# Altium project Hyperloop_BTCU.PrjPcb
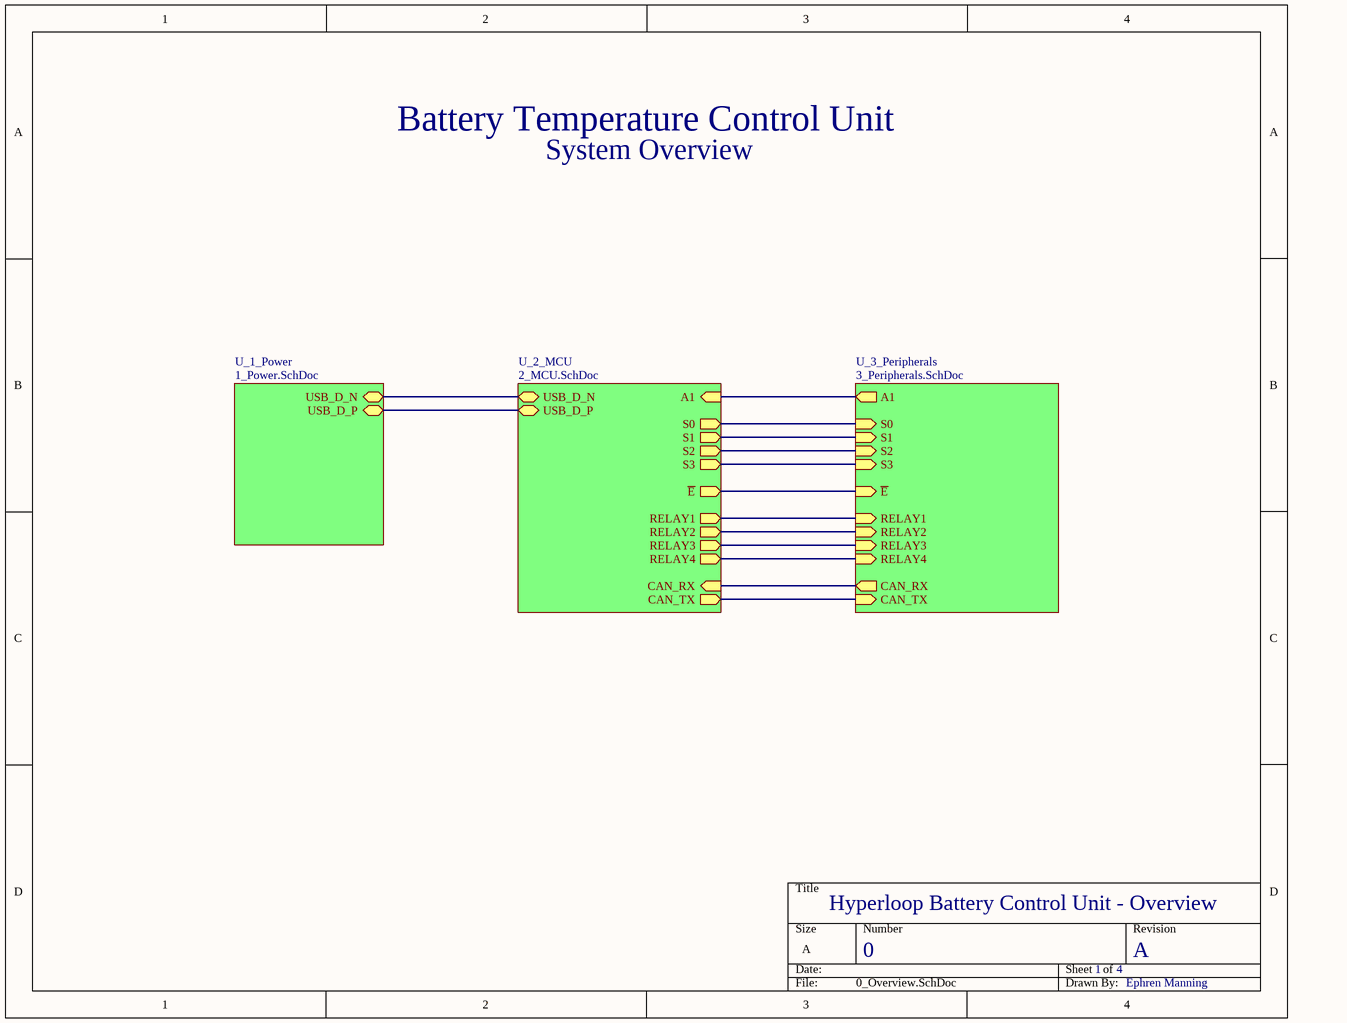
[diagram p0: 0_Overview.SchDoc]
4 sheets, 103 parts. Net scope: hierarchical (ports join the sheet entries above them; power ports are global).
Board file: Hyperloop_BTCU-PCB.PcbDoc
Sheets:
  0_Overview.SchDoc
    U_1_Power = 1_Power.SchDoc
    U_2_MCU = 2_MCU.SchDoc
    U_3_Peripherals = 3_Peripherals.SchDoc

## Sheet 0_Overview.SchDoc
size A; SheetNumber: 1; SheetTotal: 4

### Sub-sheets
U_1_Power = 1_Power.SchDoc: USB_D_N (bidir), USB_D_P (bidir)
U_2_MCU = 2_MCU.SchDoc: USB_D_P (bidir), USB_D_N (bidir), A1 (in), S0 (out), S1 (out), S2 (out), S3 (out), RELAY1 (out), RELAY2 (out), RELAY3 (out), RELAY4 (out), ~{E} (out), CAN_RX (in), CAN_TX (out)
U_3_Peripherals = 3_Peripherals.SchDoc: CAN_TX (in), CAN_RX (out), S0 (in), S1 (in), S2 (in), S3 (in), ~{E} (in), A1 (out), RELAY1 (in), RELAY2 (in), RELAY3 (in), RELAY4 (in)

### Nets
USB_D_N: sheet U_1_Power/USB_D_N, sheet U_2_MCU/USB_D_N
USB_D_P: sheet U_1_Power/USB_D_P, sheet U_2_MCU/USB_D_P
NetC6_2: sheet U_2_MCU/A1, sheet U_3_Peripherals/A1
NetR16_1: sheet U_2_MCU/RELAY1, sheet U_3_Peripherals/RELAY1
NetR18_1: sheet U_2_MCU/RELAY2, sheet U_3_Peripherals/RELAY2
NetR20_1: sheet U_2_MCU/RELAY3, sheet U_3_Peripherals/RELAY3
NetR22_1: sheet U_2_MCU/RELAY4, sheet U_3_Peripherals/RELAY4
NetR25_2: sheet U_2_MCU/~{E}, sheet U_3_Peripherals/~{E}
NetU4_28: sheet U_2_MCU/S3, sheet U_3_Peripherals/S3
NetU4_29: sheet U_2_MCU/S2, sheet U_3_Peripherals/S2
NetU4_30: sheet U_2_MCU/S1, sheet U_3_Peripherals/S1
NetU4_31: sheet U_2_MCU/S0, sheet U_3_Peripherals/S0
NetU4_45: sheet U_2_MCU/CAN_TX, sheet U_3_Peripherals/CAN_TX
NetU4_46: sheet U_2_MCU/CAN_RX, sheet U_3_Peripherals/CAN_RX

### Notes on the sheet
- Battery Temperature Control Unit
- System Overview
- Hyperloop Battery Control Unit - Overview
- 0
- 1
- 4
- A
- Ephren Manning

## Sheet 1_Power.SchDoc
size A; SheetNumber: 2; SheetTotal: 4
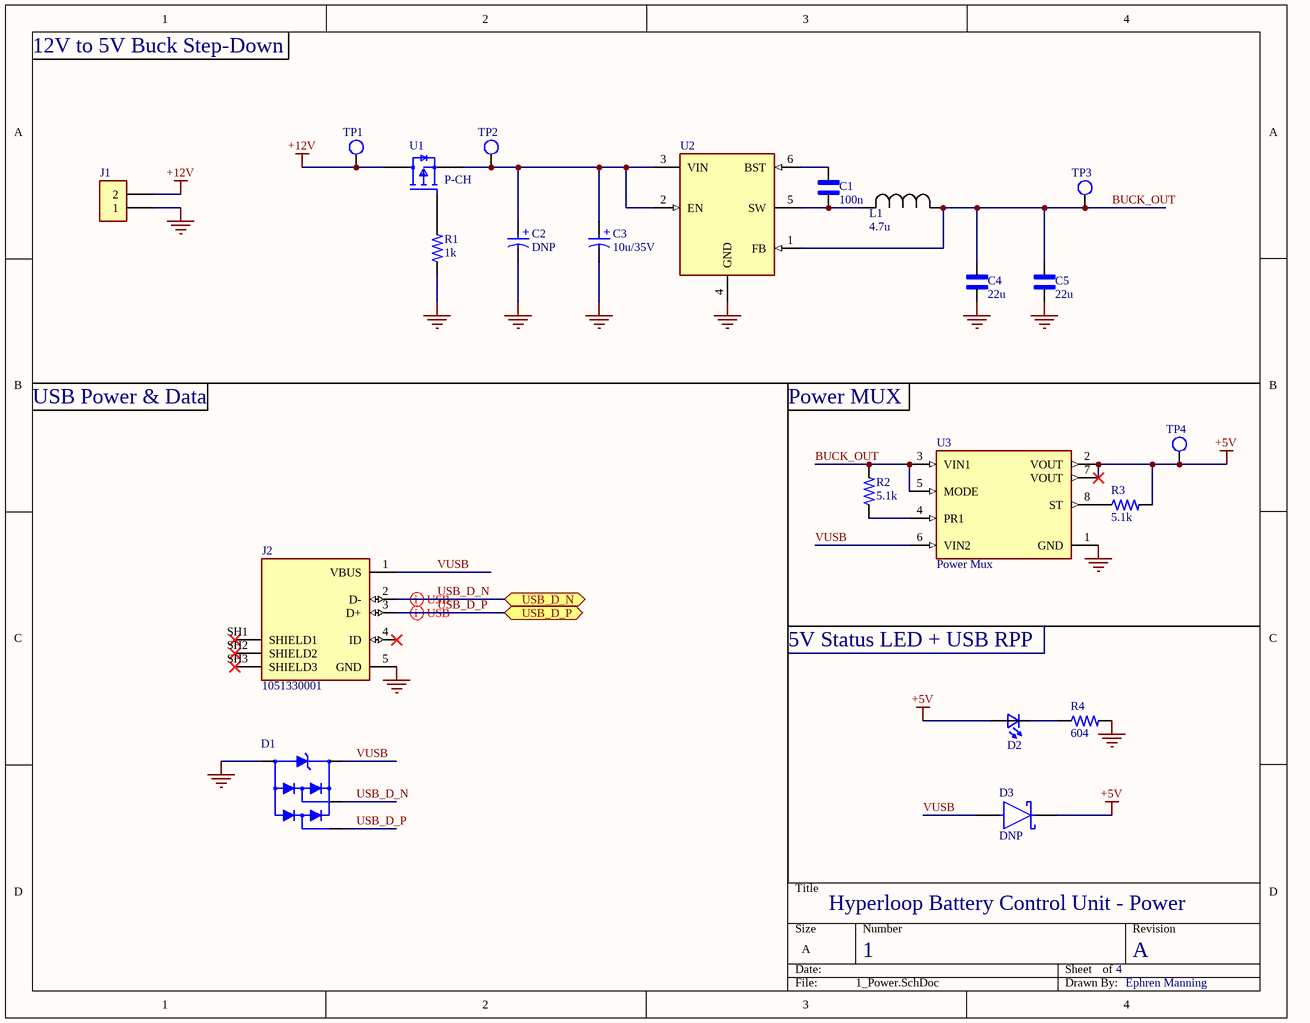
[diagram p1: 1_Power.SchDoc]

### Parts
C1  100n  [CAP_0603-Footprint]
C2  DNP  [WCAP-AS5H_D5H5.5]
C3  10u/35V  [WCAP-AS5H_D5H5.5]
C4  22u  [CAP_0603-Footprint]
C5  22u  [CAP_0603-Footprint]
D1  PRTR5V0U2X,215  [SOT143B]  (value not drawn)
D2  LTST-C191KGKT  [LED_0603-Footprint-1]  (value not drawn)
D3  DNP  [FP-SOD123W-MFG]
J1  282837-2  [TE_282837-2]  (value not drawn)
J2  1051330001  [MOLEX_1051330001]
L1  4.7u  [IND_SRP0412-1R0K_BRN]
R1  1k  [RES_0603-Footprint-1]
R2  5.1k  [RES_0603-Footprint-1]
R3  5.1k  [RES_0603-Footprint-1]
R4  604  [RES_0603-Footprint-1]
TP1  PTH Test Point  [PTH Test Point-Footprint-1]  (value not drawn)
TP2  PTH Test Point  [PTH Test Point-Footprint-1]  (value not drawn)
TP3  PTH Test Point  [PTH Test Point-Footprint-1]  (value not drawn)
TP4  PTH Test Point  [PTH Test Point-Footprint-1]  (value not drawn)
U1  P-CH  [SOT95P242X110-3N]
U2  AP63205WU-7  [FP-TSOT26-MFG]  (value not drawn)
U3  Power Mux  [SOTFL50P160X60-8N]

### Ports
USB_D_N (bidir, see 0_Overview[2B], 2_MCU[1A]), USB_D_P (bidir, see 0_Overview[2B], 2_MCU[1A])

### Nets
+5V: D2.2(A2) D3.1 R3.2 TP4.1 U3.2(VOUT) U3.7(VOUT)
+12V: J1.2 TP1.1 U1.3(Drain)
GND: C2.2(N) C3.2(N) C4.1 C5.1 D1.1(P$1) J1.1 J2.5(GND) R1.1 R4.2 U2.4(GND) U3.1(GND)
BUCK_OUT: C4.2 C5.2 L1.1 R2.2 TP3.1 U2.1(FB) U3.3(VIN1) U3.5(MODE)
USB_D_N: D1.2(P$2) J2.2(D-) ; port USB_D_N
USB_D_P: D1.3(P$3) J2.3(D+) ; port USB_D_P
VUSB: D1.4(P$4) D3.2 J2.1(VBUS) U3.6(VIN2)
NetC1_1: C1.1 L1.2 U2.5(SW)
NetC1_2: C1.2 U2.6(BST)
NetC2_1: C2.1(P) C3.1(P) TP2.1 U1.2(Source) U2.2(EN) U2.3(VIN)
NetD2_1: D2.1(K2) R4.1
NetR1_2: R1.2 U1.1(Gate)
NetR2_1: R2.1 U3.4(PR1)
NetR3_1: R3.1 U3.8(ST)

Not connected (* = marked no-connect by the designer): J2 4(ID)* SH1(SHIELD1)* SH2(SHIELD2)* SH3(SHIELD3)*

### Layout directives
differential pair: USB_D_N, USB_D_P

### Notes on the sheet
- 12V to 5V Buck Step-Down
- USB Power & Data
- Power MUX
- 5V Status LED + USB RPP
- Hyperloop Battery Control Unit - Power
- 1
- 4
- A
- Ephren Manning
- (in symbol CMP-00028-2) +

### Library data of the parts
C1 = CMP-00029-2: 100nF/16V ±10% Ceramic 0603; Manufacturer Part Number 1: CL10B104KO8NNNC; Manufacturer 1: Samsung Electro-Mechanics
C2 C3 = CMP-00028-2: ALUM 10uF 20% 35V SMD; Manufacturer 1: Würth Elektronik; Manufacturer Part Number 1: 865230542002
C4 C5 = CMP-00030-1: 22uF/10V CER 0603; Manufacturer Part Number 1: CL10A226MP8NUNE; Manufacturer 1: Samsung Electro-Mechanics
D1 = CMP-018-000000-4: Diode Array, ESD; Manufacturer 1: Nexperia USA Inc.; Manufacturer Part Number 1: PRTR5V0U2X,215
D2 = CMP-038-000000-5: Green 571nm LED Indication - Discrete 2V 0603 (1608 Metric); Manufacturer 1: Lite-On Inc.; Manufacturer Part Number 1: LTST-C191KGKT
D3 = CMP-00005-2: DIODE SCHOTTKY 60V 2A SOD123; RoHS Compliant: Yes
J1 = CMP-079-000000-3: 2x Screw Terminal; Manufacturer 1: TE Connectivity; Manufacturer Part Number 1: 282837-2
J2 = CMP-016-000000-5: Micro USB Type B 90 Degree Conn; Manufacturer 1: Molex; Manufacturer Part Number 1: 1051330001
L1 = CMP-007-000000-4: 4.7 uH 2.8A Inductor; Manufacturer 1: Bourns Electronics; Manufacturer Part Number 1: SRP0415-4R7K
R1 = CMP-00039-1: 1k 1% 0.1W 0603; Manufacturer 1: YAGEO; Manufacturer Part Number 1: RC0603FR-071KL
R2 R3 = CMP-028-000000-5: 5.1k Ohms ±1% 0.1W 0603; Manufacturer Part Number 1: RC0603FR-075K1L; Manufacturer 1: Yageo
R4 = CMP-00040-1: 604 Ohm 1% 1/10 W 0603; Manufacturer Part Number 1: RC0603FR-07604RL; Manufacturer 1: YAGEO
TP1-TP4 = CMP-00011-2: Plated through-hole test point to allow soldering in pin headers.
U1 = CMP-00025-1: Mosfet P-CH 30V 3.8A Vgs(ON) = -10V SOT23; Manufacturer 1: Diodes Incorporated; Manufacturer Part Number 1: DMP3099L-7
U2 = CMP-00003-3: AP63205 Series 32 V 2 A 1.1 MHz Synchronous Buck Converter -TSOT-26
U3 = CMP-064-000000-3: TPS2116, Power Mux, 1.6V to 5.5V, 2.5A, SOT-583; Manufacturer 1: Texas Instruments; Manufacturer Part Number 1: TPS2116DRLR; Package: SOT-583

## Sheet 2_MCU.SchDoc
size A; SheetNumber: 3; SheetTotal: 4
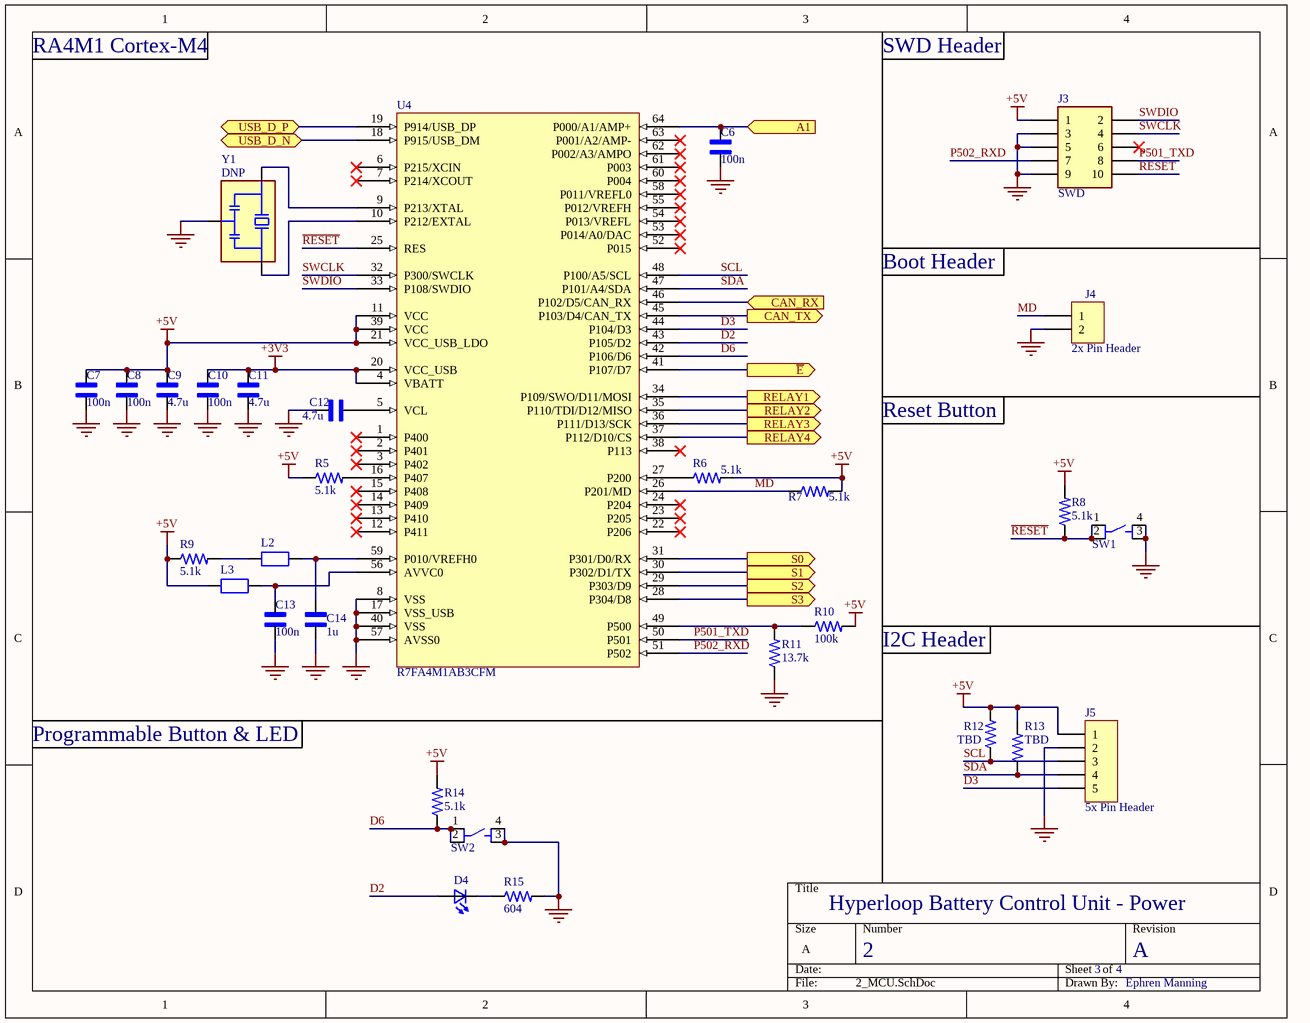
[diagram p2: 2_MCU.SchDoc]

### Parts
C6  100n  [CAP_0603-Footprint]
C7  100n  [CAP_0603-Footprint]
C8  100n  [CAP_0603-Footprint]
C9  4.7u  [CAP_0603-Footprint]
C10  100n  [CAP_0603-Footprint]
C11  4.7u  [CAP_0603-Footprint]
C12  4.7u  [CAP_0603-Footprint]
C13  100n  [CAP_0603-Footprint]
C14  1u  [CAP_0603-Footprint]
D4  LTST-C191KGKT  [LED_0603-Footprint-1]  (value not drawn)
J3  SWD  [CNC_3221-10-0100-00]
J4  2x Pin Header  [2x Pin Header-Footprint-1]
J5  5x Pin Header  [5x Pin Header-Footprint-1]
L2  BLM18PG471SN1D  [BEADC1608X95N]  (value not drawn)
L3  BLM18PG471SN1D  [BEADC1608X95N]  (value not drawn)
R5  5.1k  [RES_0603-Footprint-1]
R6  5.1k  [RES_0603-Footprint-1]
R7  5.1k  [RES_0603-Footprint-1]
R8  5.1k  [RES_0603-Footprint-1]
R9  5.1k  [RES_0603-Footprint-1]
R10  100k  [RES_0603-Footprint-1]
R11  13.7k  [RES_0603-Footprint-1]
R12  TBD  [RES_0603-Footprint-1]
R13  TBD  [RES_0603-Footprint-1]
R14  5.1k  [RES_0603-Footprint-1]
R15  604  [RES_0603-Footprint-1]
SW1  PTS810_SJM_250_SMTR_LFS  [SW_PTS810_SJM_250_SMTR_LFS]  (value not drawn)
SW2  PTS810_SJM_250_SMTR_LFS  [SW_PTS810_SJM_250_SMTR_LFS]  (value not drawn)
U4  R7FA4M1AB3CFM  [R7FA4M1AB3CFM-Footprint-1]
Y1  DNP  [OSC_CSTNE12M0G55Z000R0]

### Ports
A1 (in, see 0_Overview[3B], 3_Peripherals[2C]), CAN_RX (in, see 0_Overview[3C], 3_Peripherals[2A]), CAN_TX (out, see 0_Overview[3C], 3_Peripherals[2A]), RELAY1 (out, see 0_Overview[3C], 3_Peripherals[1A]), RELAY2 (out, see 0_Overview[3C], 3_Peripherals[1B]), RELAY3 (out, see 0_Overview[3C], 3_Peripherals[1C]), RELAY4 (out, see 0_Overview[3C], 3_Peripherals[1D]), S0 (out, see 0_Overview[3B], 3_Peripherals[2C]), S1 (out, see 0_Overview[3B], 3_Peripherals[2C]), S2 (out, see 0_Overview[3B], 3_Peripherals[2C]), S3 (out, see 0_Overview[3B], 3_Peripherals[2C]), USB_D_N (bidir, see 0_Overview[2B], 1_Power[2C]), USB_D_P (bidir, see 0_Overview[2B], 1_Power[2C]), ~{E} (out, see 0_Overview[3B], 3_Peripherals[2C])

### Nets
+3V3: C10.2 C11.2 U4.4(VBATT) U4.20(VCC_USB)
+5V: C7.2 C8.2 C9.2 J3.1 J5.1 L3.1 R5.1 R6.2 R7.2 R8.2 R9.1 R10.2 R12.2 R13.2 R14.2 U4.11(VCC) U4.21(VCC_USB_LDO) U4.39(VCC)
GND: C6.1 C7.1 C8.1 C9.1 C10.1 C11.1 C12.1 C13.1 C14.1 J3.3 J3.5 J3.9 J4.2 J5.2 R11.1 R15.2 SW1.3 SW1.4 SW2.3 SW2.4 U4.8(VSS) U4.17(VSS_USB) U4.40(VSS) U4.57(AVSS0) Y1.2(GND)
D2: D4.2(A2) U4.43(P105/D2)
D3: J5.5 U4.44(P104/D3)
D6: R14.1 SW2.1 SW2.2 U4.42(P106/D6)
MD: J4.1 R7.1 U4.26(P201/MD)
P501_TXD: J3.8 U4.50(P501)
P502_RXD: J3.7 U4.51(P502)
~{RESET}: J3.10 R8.1 SW1.1 SW1.2 U4.25(RES)
SCL: J5.3 R12.1 U4.48(P100/A5/SCL)
SDA: J5.4 R13.1 U4.47(P101/A4/SDA)
SWCLK: J3.4 U4.32(P300/SWCLK)
SWDIO: J3.2 U4.33(P108/SWDIO)
USB_D_N: U4.18(P915/USB_DM) ; port USB_D_N
USB_D_P: U4.19(P914/USB_DP) ; port USB_D_P
NetC6_2: C6.2 U4.64(P000/A1/AMP+) ; port A1
NetC12_2: C12.2 U4.5(VCL)
NetC13_2: C13.2 L3.2 U4.56(AVVC0)
NetC14_2: C14.2 L2.2 U4.59(P010/VREFH0)
NetD4_1: D4.1(K2) R15.1
NetL2_1: L2.1 R9.2
NetR5_2: R5.2 U4.16(P407)
NetR6_1: R6.1 U4.27(P200)
NetR10_1: R10.1 R11.2 U4.49(P500)
NetR16_1: U4.34(P109/SWO/D11/MOSI) ; port RELAY1
NetR18_1: U4.35(P110/TDI/D12/MISO) ; port RELAY2
NetR20_1: U4.36(P111/D13/SCK) ; port RELAY3
NetR22_1: U4.37(P112/D10/CS) ; port RELAY4
NetR25_2: U4.41(P107/D7) ; port ~{E}
NetU4_9: U4.9(P213/XTAL) Y1.1(IN)
NetU4_10: U4.10(P212/EXTAL) Y1.3(OUT)
NetU4_28: U4.28(P304/D8) ; port S3
NetU4_29: U4.29(P303/D9) ; port S2
NetU4_30: U4.30(P302/D1/TX) ; port S1
NetU4_31: U4.31(P301/D0/RX) ; port S0
NetU4_45: U4.45(P103/D4/CAN_TX) ; port CAN_TX
NetU4_46: U4.46(P102/D5/CAN_RX) ; port CAN_RX

Not connected (* = marked no-connect by the designer): J3 6*; U4 1(P400)* 2(P401)* 3(P402)* 6(P215/XCIN)* 7(P214/XCOUT)* 12(P411)* 13(P410)* 14(P409)* 15(P408)* 22(P206)* 23(P205)* 24(P204)* 38(P113)* 52(P015)* 53(P014/A0/DAC)* 54(P013/VREFL)* 55(P012/VREFH)* 58(P011/VREFL0)* 60(P004)* 61(P003)* 62(P002/A3/AMPO)* 63(P001/A2/AMP-)*

### Notes on the sheet
- RA4M1 Cortex-M4
- SWD Header
- Boot Header
- Reset Button
- (near R10) I2C Header
- Programmable Button & LED
- Hyperloop Battery Control Unit - Power
- 2
- 3
- 4
- A
- Ephren Manning

### Library data of the parts
C6-C8 C10 C13 = CMP-00029-2: as C1 on sheet 1_Power
C9 C11 C12 = CMP-00032-1: 4.7uF/10V 0603 Ceramic Capacitor; Manufacturer 1: Samsung Electro-Mechanics; Manufacturer Part Number 1: CL10A475KP8NNNC
C14 = CMP-026-000000-4: 1uF/10V ±10% 0603; Manufacturer Part Number 1: CL10B105KP8NNNC; Manufacturer 1: Samsung Electro-Mechanics
D4 = CMP-038-000000-5: as D2 on sheet 1_Power; Manufacturer Part Number 1: LTST-C191KGKT
J3 = CMP-012-000000-3: SWD Connector; Manufacturer 1: CNC Tech; Manufacturer Part Number 1: 3221-10-0100-00
J4 = CMP-00012-3
J5 = CMP-00034-2
L2 L3 = CMP-024-000000-4: Ferrite Bead, 0603, 470 Ohms @ 100MHz; Manufacturer 1: Murata; Manufacturer Part Number 1: BLM18PG471SN1D
R5-R9 R12-R14 = CMP-028-000000-5: as R2 on sheet 1_Power
R10 = CMP-030-000000-4: 100k ±1% 0.1W, 0603; Manufacturer Part Number 1: RC0603FR-07100KL; Manufacturer 1: Yageo
R11 = CMP-032-000000-3: 13.7K 1% 0,1W 0603; Manufacturer 1: YAGEO; Manufacturer Part Number 1: RC0603FR-0713K7L
R15 = CMP-00040-1: as R4 on sheet 1_Power
SW1 SW2 = CMP-014-000000-3: Tactile Switch SPST-NO Top Actuated Surface Mount; Manufacturer 1: C&K; Manufacturer Part Number 1: PTS810 SJM 250 SMTR LFS
U4 = CMP-00000-7: RA4M1 Cortex-M4 Microcontroller 64-LQFP; Manufacturer Part Number 1: R7FA4M1AB3CFM#AA0; Manufacturer 1: Renesas
Y1 = CMP-072-000000-4: 12MHz Ceramic Resonator Built in Capacitor 33pF ±0.2% 30 Ohms Surface Mount; Manufacturer 1: Murata Electronics; Manufacturer Part Number 1: CSTNE12M0G55Z000R0

## Sheet 3_Peripherals.SchDoc
size A; SheetNumber: 4; SheetTotal: 4
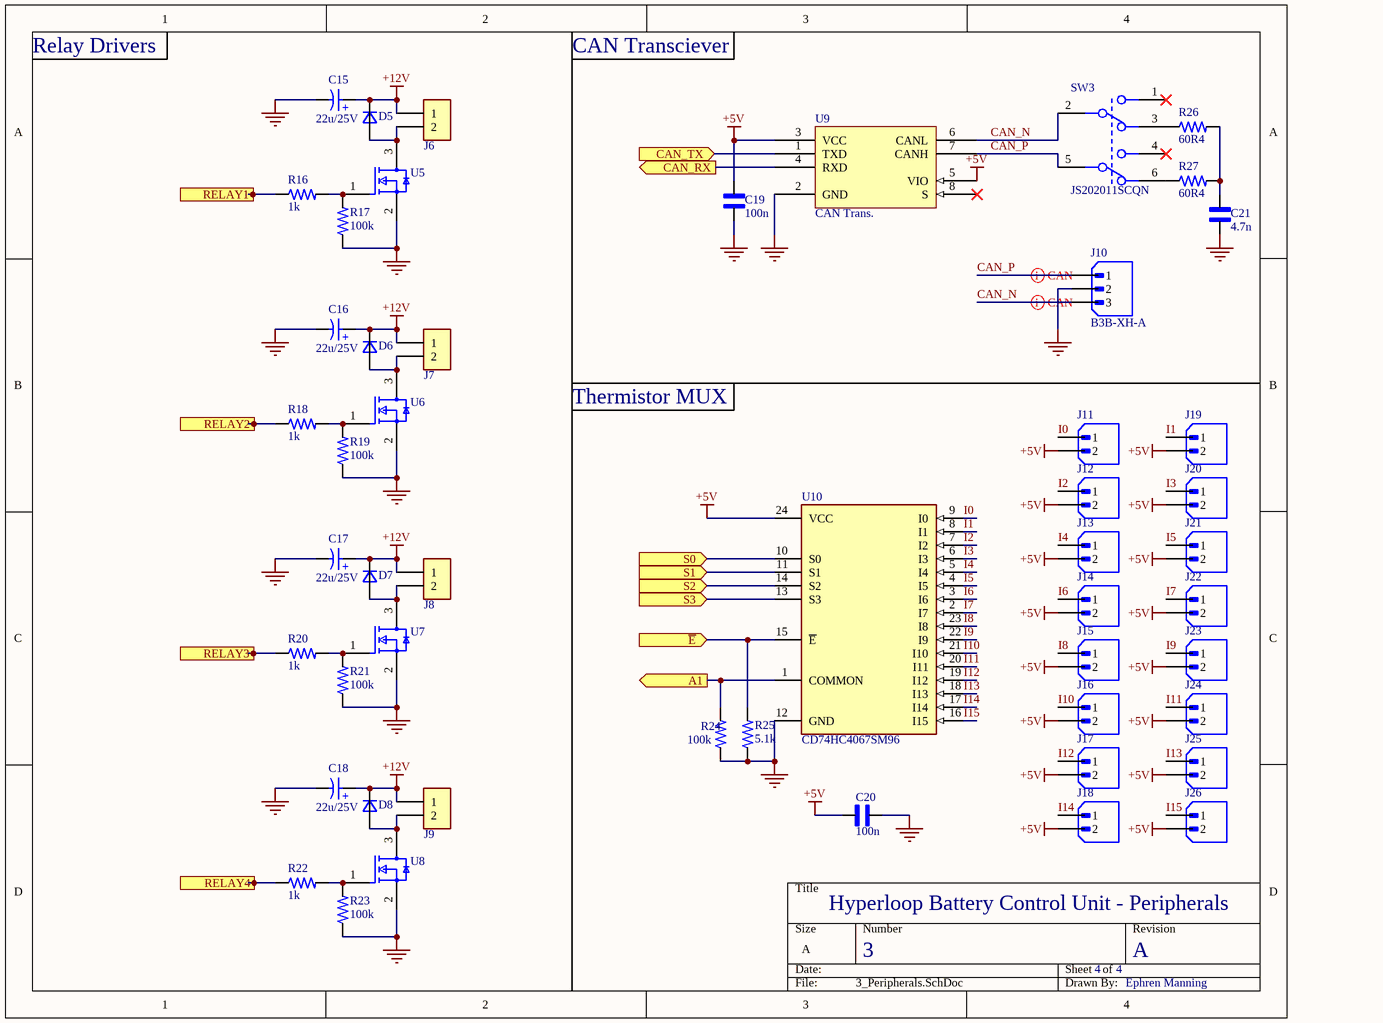
[diagram p3: 3_Peripherals.SchDoc]

### Parts
C15  22u/25V  [WCAP-ASLI_D5H5.5]
C16  22u/25V  [WCAP-ASLI_D5H5.5]
C17  22u/25V  [WCAP-ASLI_D5H5.5]
C18  22u/25V  [WCAP-ASLI_D5H5.5]
C19  100n  [CAP_0603-Footprint]
C20  100n  [CAP_0603-Footprint]
C21  4.7n  [CAP_0603-Footprint]
D5  1N4007FL  [SOD-123_ONS]  (value not drawn)
D6  1N4007FL  [SOD-123_ONS]  (value not drawn)
D7  1N4007FL  [SOD-123_ONS]  (value not drawn)
D8  1N4007FL  [SOD-123_ONS]  (value not drawn)
J6  282837-2  [TE_282837-2]  (value not drawn)
J7  282837-2  [TE_282837-2]  (value not drawn)
J8  282837-2  [TE_282837-2]  (value not drawn)
J9  282837-2  [TE_282837-2]  (value not drawn)
J10  B3B-XH-A  [JST_B3B-XH-A]
J11  B2B-XH-A  [JST_B2B-XH-A]  (value not drawn)
J12  B2B-XH-A  [JST_B2B-XH-A]  (value not drawn)
J13  B2B-XH-A  [JST_B2B-XH-A]  (value not drawn)
J14  B2B-XH-A  [JST_B2B-XH-A]  (value not drawn)
J15  B2B-XH-A  [JST_B2B-XH-A]  (value not drawn)
J16  B2B-XH-A  [JST_B2B-XH-A]  (value not drawn)
J17  B2B-XH-A  [JST_B2B-XH-A]  (value not drawn)
J18  B2B-XH-A  [JST_B2B-XH-A]  (value not drawn)
J19  B2B-XH-A  [JST_B2B-XH-A]  (value not drawn)
J20  B2B-XH-A  [JST_B2B-XH-A]  (value not drawn)
J21  B2B-XH-A  [JST_B2B-XH-A]  (value not drawn)
J22  B2B-XH-A  [JST_B2B-XH-A]  (value not drawn)
J23  B2B-XH-A  [JST_B2B-XH-A]  (value not drawn)
J24  B2B-XH-A  [JST_B2B-XH-A]  (value not drawn)
J25  B2B-XH-A  [JST_B2B-XH-A]  (value not drawn)
J26  B2B-XH-A  [JST_B2B-XH-A]  (value not drawn)
R16  1k  [RES_0603-Footprint-1]
R17  100k  [RES_0603-Footprint-1]
R18  1k  [RES_0603-Footprint-1]
R19  100k  [RES_0603-Footprint-1]
R20  1k  [RES_0603-Footprint-1]
R21  100k  [RES_0603-Footprint-1]
R22  1k  [RES_0603-Footprint-1]
R23  100k  [RES_0603-Footprint-1]
R24  100k  [RES_0603-Footprint-1]
R25  5.1k  [RES_0603-Footprint-1]
R26  60R4  [RES_0603-Footprint-1]
R27  60R4  [RES_0603-Footprint-1]
SW3  JS202011SCQN  [FP-JS202011SCQN-MFG]
U5  PMV20XNER  [SOT95P230X110-3N]  (value not drawn)
U6  PMV20XNER  [SOT95P230X110-3N]  (value not drawn)
U7  PMV20XNER  [SOT95P230X110-3N]  (value not drawn)
U8  PMV20XNER  [SOT95P230X110-3N]  (value not drawn)
U9  CAN Trans.  [SOIC127P600X175-8N]
U10  CD74HC4067SM96  [CD74HC4067SM96 - SSOP24]

### Ports
A1 (out, see 0_Overview[3B], 2_MCU[3A]), CAN_RX (out, see 0_Overview[3C], 2_MCU[3B]), CAN_TX (in, see 0_Overview[3C], 2_MCU[3B]), RELAY1 (in, see 0_Overview[3C], 2_MCU[3B]), RELAY2 (in, see 0_Overview[3C], 2_MCU[3B]), RELAY3 (in, see 0_Overview[3C], 2_MCU[3B]), RELAY4 (in, see 0_Overview[3C], 2_MCU[3B]), S0 (in, see 0_Overview[3B], 2_MCU[3C]), S1 (in, see 0_Overview[3B], 2_MCU[3C]), S2 (in, see 0_Overview[3B], 2_MCU[3C]), S3 (in, see 0_Overview[3B], 2_MCU[3C]), ~{E} (in, see 0_Overview[3B], 2_MCU[3B])

### Nets
+5V: C19.2 C20.2 J11.2 J12.2 J13.2 J14.2 J15.2 J16.2 J17.2 J18.2 J19.2 J20.2 J21.2 J22.2 J23.2 J24.2 J25.2 J26.2 U9.3(VCC) U9.5(VIO) U10.24(VCC)
+12V: C15.1(P) C16.1(P) C17.1(P) C18.1(P) D5.1(K) D6.1(K) D7.1(K) D8.1(K) J6.1 J7.1 J8.1 J9.1
GND: C15.2(N) C16.2(N) C17.2(N) C18.2(N) C19.1 C20.1 C21.1 J10.2 R17.1 R19.1 R21.1 R23.1 R24.1 R25.1 U5.2(Source) U6.2(Source) U7.2(Source) U8.2(Source) U9.2(GND) U10.12(GND)
CAN_N: J10.3 SW3.2 U9.6(CANL)
CAN_P: J10.1 SW3.5 U9.7(CANH)
I0: J11.1 U10.9(I0)
I1: J19.1 U10.8(I1)
I2: J12.1 U10.7(I2)
I3: J20.1 U10.6(I3)
I4: J13.1 U10.5(I4)
I5: J21.1 U10.4(I5)
I6: J14.1 U10.3(I6)
I7: J22.1 U10.2(I7)
I8: J15.1 U10.23(I8)
I9: J23.1 U10.22(I9)
I10: J16.1 U10.21(I10)
I11: J24.1 U10.20(I11)
I12: J17.1 U10.19(I12)
I13: J25.1 U10.18(I13)
I14: J18.1 U10.17(I14)
I15: J26.1 U10.16(I15)
NetC6_2: R24.2 U10.1(COMMON) ; port A1
NetC21_2: C21.2 R26.2 R27.2
NetD5_2: D5.2(A) J6.2 U5.3(Drain)
NetD6_2: D6.2(A) J7.2 U6.3(Drain)
NetD7_2: D7.2(A) J8.2 U7.3(Drain)
NetD8_2: D8.2(A) J9.2 U8.3(Drain)
NetR16_1: R16.1 ; port RELAY1
NetR16_2: R16.2 R17.2 U5.1(Gate)
NetR18_1: R18.1 ; port RELAY2
NetR18_2: R18.2 R19.2 U6.1(Gate)
NetR20_1: R20.1 ; port RELAY3
NetR20_2: R20.2 R21.2 U7.1(Gate)
NetR22_1: R22.1 ; port RELAY4
NetR22_2: R22.2 R23.2 U8.1(Gate)
NetR25_2: R25.2 U10.15(~{E}) ; port ~{E}
NetR26_1: R26.1 SW3.3
NetR27_1: R27.1 SW3.6
NetU4_28: U10.13(S3) ; port S3
NetU4_29: U10.14(S2) ; port S2
NetU4_30: U10.11(S1) ; port S1
NetU4_31: U10.10(S0) ; port S0
NetU4_45: U9.1(TXD) ; port CAN_TX
NetU4_46: U9.4(RXD) ; port CAN_RX

Not connected (* = marked no-connect by the designer): SW3 1* 4*; U9 8(S)*

### Layout directives
differential pair: CAN_N, CAN_P

### Notes on the sheet
- Relay Drivers
- CAN Transciever
- Thermistor MUX
- Hyperloop Battery Control Unit - Peripherals
- 3
- 4
- A
- Ephren Manning
- (in symbol CMP-00027-1) +

### Library data of the parts
C15-C18 = CMP-00027-1: 22uF/25V Alum; Manufacturer 1: Würth Elektronik; Manufacturer Part Number 1: 865080442004
C19 C20 = CMP-00029-2: as C1 on sheet 1_Power
C21 = CMP-00036-1: 4.7nF/16V 0603 Ceramic Cap; Manufacturer 1: Walsin Technology Corporation; Manufacturer Part Number 1: 0603B472K160CT
D5-D8 = CMP-00038-2: 1000V 1A Diode; Manufacturer 1: SMC Diode Solutions; Manufacturer Part Number 1: 1N4007FL
J6-J9 = CMP-079-000000-3: as J1 on sheet 1_Power; Manufacturer Part Number 1: 282837-2
J10 = CMP-082-000000-2: 3x Pin JST-XH-A; Manufacturer 1: JST Sales; Manufacturer Part Number 1: B3B-XH-A
J11-J26 = CMP-074-000001-3: 2x Pin JST-XH; Manufacturer 1: JST Sales America; Manufacturer Part Number 1: B2B-XH-A
R16 R18 R20 R22 = CMP-00039-1: as R1 on sheet 1_Power
R17 R19 R21 R23 R24 = CMP-030-000000-4: 100k ±1% 0.1W, 0603; Manufacturer 1: Yageo; Manufacturer Part Number 1: RC0603FR-07100KL
R25 = CMP-028-000000-5: as R2 on sheet 1_Power
R26 R27 = CMP-046-000000-5: 60.4 Ohms ±1% 0.1W 0603; Manufacturer Part Number 1: RC0603FR-0760R4L; Manufacturer 1: YAGEO
SW3 = CMP-00035-2: DPDT SMD SWITCH 300mA 6V; Manufacturer 1: C&K; Manufacturer Part Number 1: JS202011SCQN
U5-U8 = CMP-076-000000-2: N-Channel 30 V 5.7A (Ta) 510mW (Ta), 6.94W (Tc) Surface Mount TO-236AB; Manufacturer 1: Nexperia USA Inc.; Manufacturer Part Number 1: PMV20XNER
U9 = CMP-00010-6: CAN Transceiver, NXP; Manufacturer Part Number 1: TJA1051T/3,118; Manufacturer 1: NXP USA Inc.
U10 = CMP-00031-4: 16:1 Mux 160 Ohm 24-SSOP; Manufacturer 1: Texas Instruments; Manufacturer Part Number 1: CD74HC4067SM96

## Nets that join several sheets
+5V: 1_Power (6 pins), 2_MCU (18 pins), 3_Peripherals (21 pins)
+12V: 1_Power (J1.2 TP1.1 U1.3), 3_Peripherals (12 pins)
GND: 1_Power (11 pins), 2_MCU (25 pins), 3_Peripherals (20 pins)
NetC6_2: 2_MCU (C6.2 U4.64), 3_Peripherals (R24.2 U10.1)
NetR16_1: 2_MCU (U4.34), 3_Peripherals (R16.1)
NetR18_1: 2_MCU (U4.35), 3_Peripherals (R18.1)
NetR20_1: 2_MCU (U4.36), 3_Peripherals (R20.1)
NetR22_1: 2_MCU (U4.37), 3_Peripherals (R22.1)
NetR25_2: 2_MCU (U4.41), 3_Peripherals (R25.2 U10.15)
NetU4_28: 2_MCU (U4.28), 3_Peripherals (U10.13)
NetU4_29: 2_MCU (U4.29), 3_Peripherals (U10.14)
NetU4_30: 2_MCU (U4.30), 3_Peripherals (U10.11)
NetU4_31: 2_MCU (U4.31), 3_Peripherals (U10.10)
NetU4_45: 2_MCU (U4.45), 3_Peripherals (U9.1)
NetU4_46: 2_MCU (U4.46), 3_Peripherals (U9.4)
USB_D_N: 1_Power (D1.2 J2.2), 2_MCU (U4.18)
USB_D_P: 1_Power (D1.3 J2.3), 2_MCU (U4.19)